# Altium schematic sheet Sheet1.SchDoc
size A4
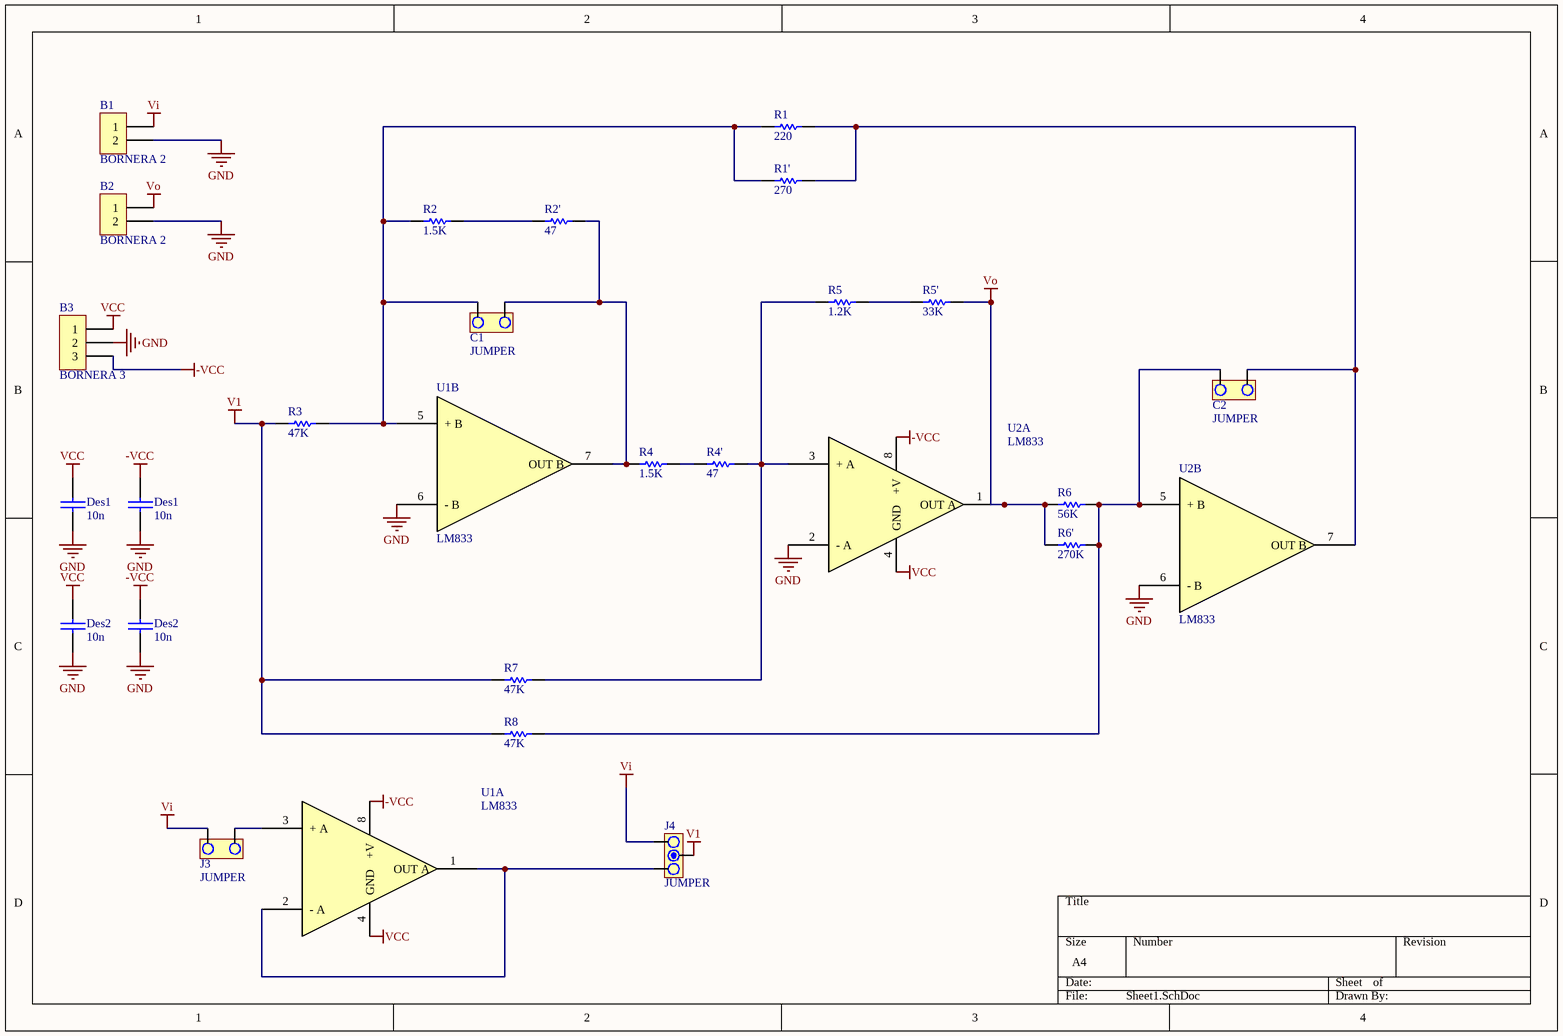
[diagram p0: Sheet1.SchDoc]

## Parts
(Parts that share a designator on the sheet are numbered #1, #2 ... from top to bottom, then left to right.)
B1  BORNERA 2  [BORNERA2]
B2  BORNERA 2  [BORNERA2]
B3  BORNERA 3  [BORNERA3]
C1  JUMPER  [JUMPER2]
C2  JUMPER  [JUMPER2]
Des1#1  10n  [0805]
Des1#2  10n  [0805]
Des2#1  10n  [0805]
Des2#2  10n  [0805]
J3  JUMPER  [JUMPER2]
J4  JUMPER  [JUMPER3]
R1  220  [0805]
R1'  270  [0805]
R2  1.5K  [0805]
R2'  47  [0805]
R3  47K  [0805]
R4  1.5K  [0805]
R4'  47  [0805]
R5  1.2K  [0805]
R5'  33K  [0805]
R6  56K  [0805]
R6'  270K  [0805]
R7  47K  [0805]
R8  47K  [0805]
U1  LM833  [DIP8]  (parts A,B of 2)
U2  LM833  [DIP8]  (parts A,B of 2)

## Nets
-VCC: B3.3 Des1#2.1 Des2#2.1 U1.8(+V) U2.8(+V)
GND: B1.2 B2.2 B3.2 Des1#1.2 Des1#2.2 Des2#1.2 Des2#2.2 U1.6(-_B) U2.2(-_A) U2.6(-_B)
V1: J4.2 R3.1 R7.1 R8.1
VCC: B3.1 Des1#1.1 Des2#1.1 U1.4(GND) U2.4(GND)
Vi: B1.1 J3.1 J4.3
Vo: B2.1 R5'.2 R6.1 R6'.1 U2.1(OUT_A)
NetC1_1: C1.1 R1.1 R1'.1 R2.1 R3.2 U1.5(+_B)
NetC1_2: C1.2 R2'.2 R4.1 U1.7(OUT_B)
NetC2_1: C2.1 R6.2 R6'.2 R8.2 U2.5(+_B)
NetC2_2: C2.2 R1.2 R1'.2 U2.7(OUT_B)
NetJ3_2: J3.2 U1.3(+_A)
NetJ4_1: J4.1 U1.1(OUT_A) U1.2(-_A)
NetR2_2: R2.2 R2'.1
NetR4'_2: R4'.2 R5.1 R7.2 U2.3(+_A)
NetR4_2: R4.2 R4'.1
NetR5_2: R5.2 R5'.1

## Library data of the parts
Des1#1 Des1#2 Des2#1 Des2#2 = CAP
J4 = JUMPER3
R1 R1' R2 R2' R3 R4 R4' R5 R5' R6 R6' R7 R8 = RES
U1 U2 = LM833: Dual Audio Operational Amplifier